# EAGLE design I2CIsoBreakoutV01 (EAGLE 6.3)
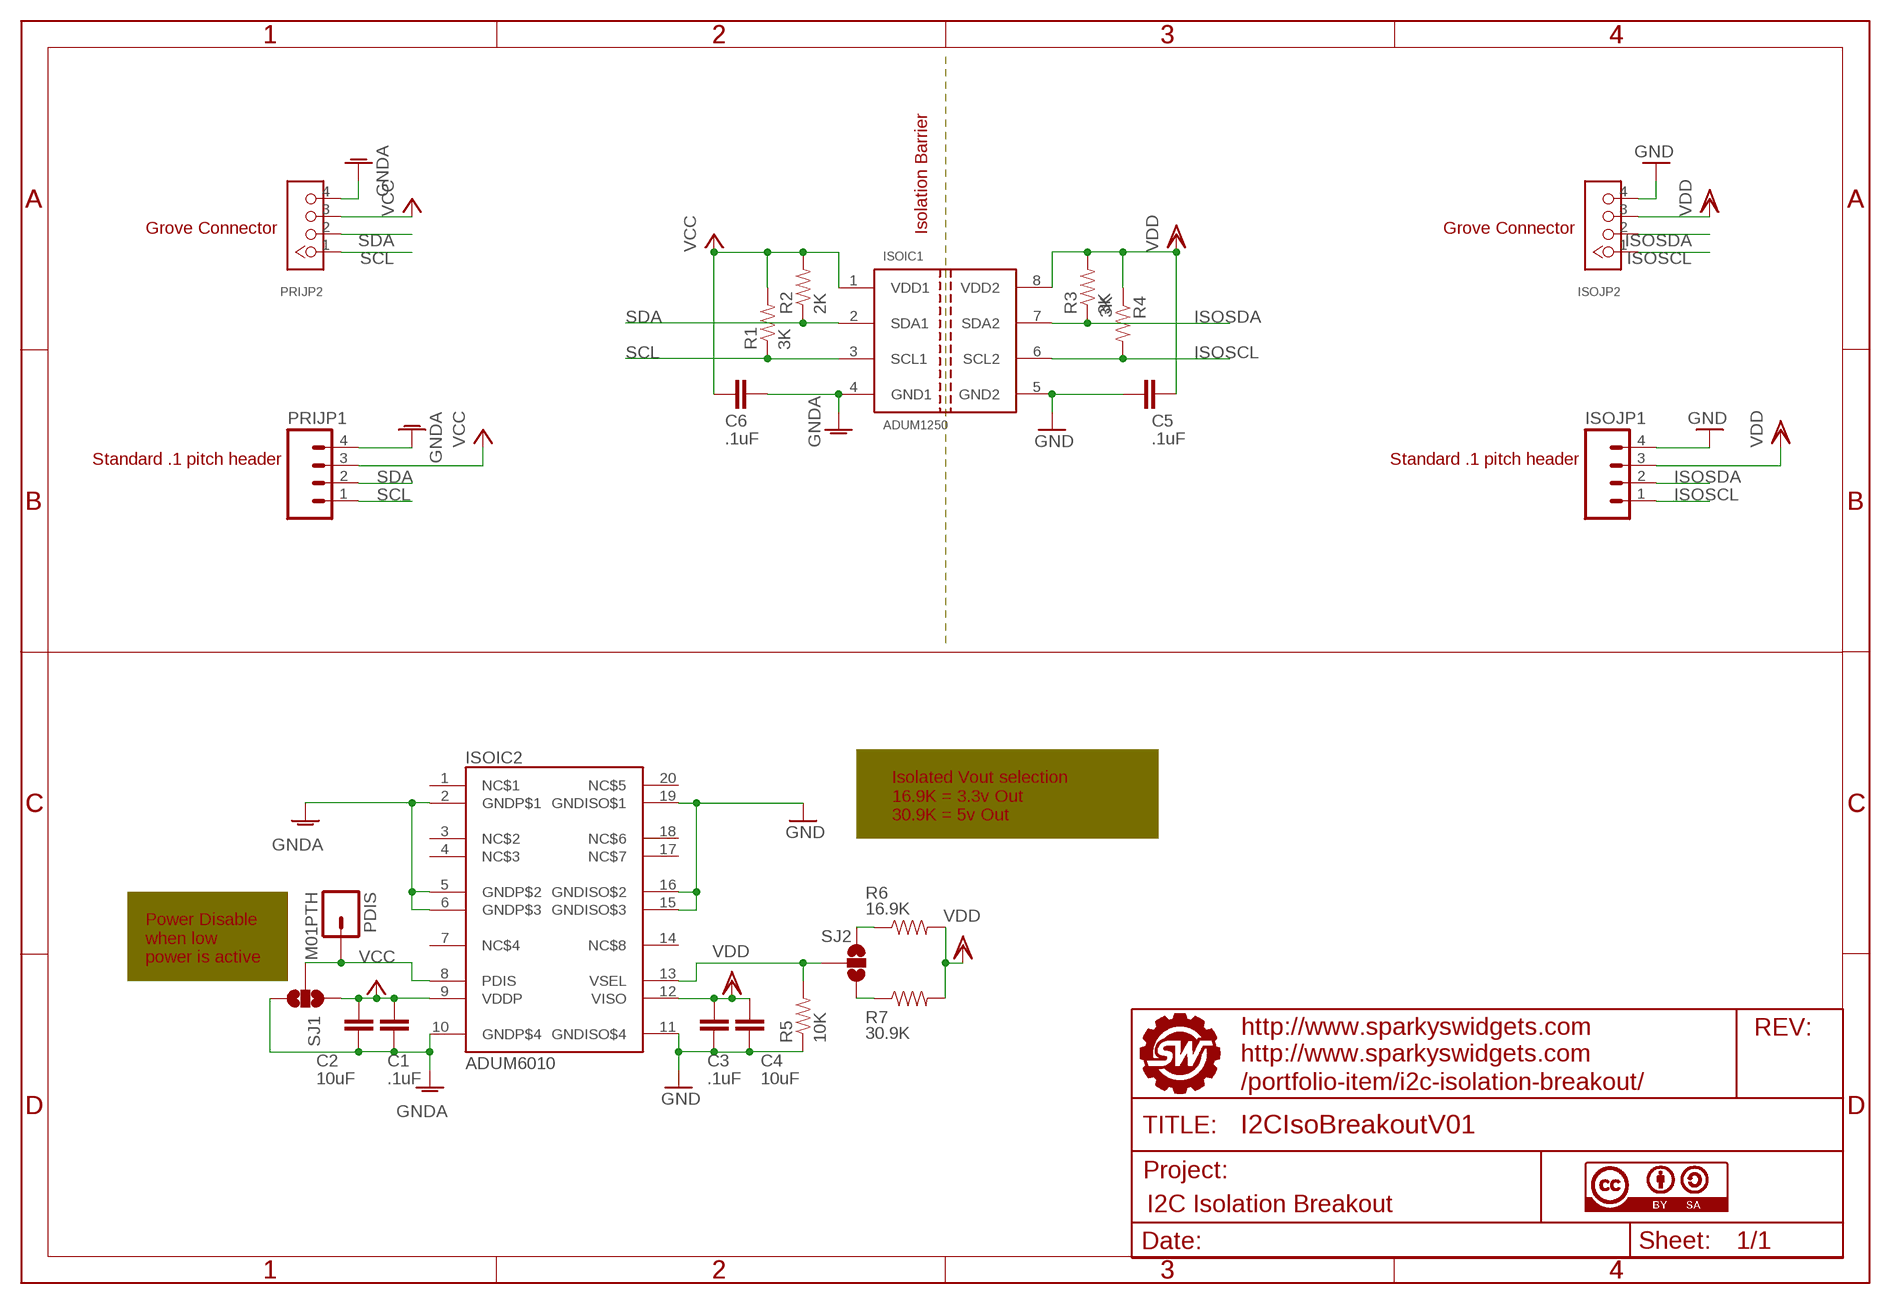
[diagram p0: schematic, sheet 1]

## Parts
C1  .1uF  CAP0805  [0805]
C2  10uF  CAP0805  [0805]
C3  .1uF  CAP0805  [0805]
C4  10uF  CAP0805  [0805]
C5  .1uF  CAP0805  [0805]
C6  .1uF  CAP0805  [0805]
ISOIC1  ADUM1250  [SO08]
ISOIC2  ADUM6010  [SSOP20]
ISOJP1  M04PTH  [1X04]
ISOJP2  TWIG-4P-2.0-2.0  [4P-2.0]
PDIS  M01PTH  [1X01]
PRIJP1  M04PTH  [1X04]
PRIJP2  TWIG-4P-2.0-2.0  [4P-2.0]
R1  3K  RESISTOR0805-RES  [0805]
R2  2K  RESISTOR0805-RES  [0805]
R3  3K  RESISTOR0805-RES  [0805]
R4  3K  RESISTOR0805-RES  [0805]
R5  10K  RESISTOR0805-RES  [0805]
R6  16.9K  RESISTOR0805-RES  [0805]
R7  30.9K  RESISTOR0805-RES  [0805]
SJ1  SOLDERJUMPER_2WAYPASTE2&3  [SJ_3_PASTE2&3]
SJ2  SOLDERJUMPER_2WAYPASTE2&3  [SJ_3_PASTE2&3]
U$1  FRAME_ISOI2CBREAKOUT  [SWPCBLOGOWITHINFO]
U$2  CC-BY-SA  [CC-BY-SA]

## Nets
GND: C3.2 C4.2 C5.1 ISOIC1.5(GND2) ISOIC2.11(GNDISO$4) ISOIC2.15(GNDISO$3) ISOIC2.16(GNDISO$2) ISOIC2.19(GNDISO$1) ISOJP1.4 ISOJP2.4 R5.1
GNDA: C1.2 C2.2 C6.1 ISOIC1.4(GND1) ISOIC2.2(GNDP$1) ISOIC2.5(GNDP$2) ISOIC2.6(GNDP$3) ISOIC2.10(GNDP$4) PRIJP1.4 PRIJP2.4 SJ1.3
ISOSCL: ISOIC1.6(SCL2) ISOJP1.1 ISOJP2.1 R4.2
ISOSDA: ISOIC1.7(SDA2) ISOJP1.2 ISOJP2.2 R3.1
N$1: ISOIC2.8(PDIS) PDIS.1 SJ1.2
N$2: ISOIC2.13(VSEL) R5.2 SJ2.2
N$3: R6.1 SJ2.1
N$4: R7.1 SJ2.3
SCL: ISOIC1.3(SCL1) PRIJP1.1 PRIJP2.1 R1.1
SDA: ISOIC1.2(SDA1) PRIJP1.2 PRIJP2.2 R2.1
VCC: C1.1 C2.1 C6.2 ISOIC1.1(VDD1) ISOIC2.9(VDDP) PRIJP1.3 PRIJP2.3 R1.2 R2.2 SJ1.1
VDD: C3.1 C4.1 C5.2 ISOIC1.8(VDD2) ISOIC2.12(VISO) ISOJP1.3 ISOJP2.3 R3.2 R4.1 R6.2 R7.2
Unconnected: ISOIC2.1(NC$1) ISOIC2.3(NC$2) ISOIC2.4(NC$3) ISOIC2.7(NC$4) ISOIC2.14(NC$8) ISOIC2.17(NC$7) ISOIC2.18(NC$6) ISOIC2.20(NC$5)

## Notes on the sheet
- Grove Connector | Isolation Barrier | Grove Connector
- Standard .1 pitch header | Standard .1 pitch header
- Isolated Vout selection
  16.9K = 3.3v Out
  30.9K = 5v Out
- Power Disable
  when low 
  power is active

## Library data of the parts
C1-C6 = SparkysWidgets:CAP: Capacitor Standard 0603 ceramic capacitor, and 0.1" leaded capacitor.
ISOIC1 = SparkysWidgets:ADUM1250: ADUM1250 Bi-Directional I2C Isolation IC AD iCoupler based tech, I2C Isolation IC, allows for Galavanically Isolated howswapable I2C devices
ISOIC2 = SparkysWidgets:ADUM6010: ADUM6010 ISO DC-DC power uModule AD iCoupler based tech, dc-dc converter. Useful for galvanically isolating supplies accepts wide inpute range and outputs regulated 3v-5.v5@150mA
ISOJP1 PRIJP1 = SparkFun:M04: Header 4 Standard 4-pin 0.1" header. Use with straight break away headers (SKU : PRT-00116), right angle break away headers (PRT-00553), swiss pins (PRT-00743), machine pins (PRT-00117), and female headers (PRT-00115). Molex polarized connector foot print use with SKU : PRT-08231 with associated crimp pins and housings. 1MM SMD Version SKU: PRT-10208
ISOJP2 PRIJP2 = Connector:TWIG-4P-2.0
PDIS = SparkFun:M01: Header 1 Standard 1-pin 0.1" header. Use with straight break away headers (SKU : PRT-00116), right angle break away headers (PRT-00553), swiss pins (PRT-00743), machine pins (PRT-00117), and female headers (PRT-00115).
R1-R7 = SparkysWidgets:RESISTOR: Resistor Basic schematic elements and footprints for 0603, 1206, and PTH resistors.
SJ1 SJ2 = SparkFun:SOLDERJUMPER_2WAY: Solder Jumper 2 way solder jumper
U$1 = SparkysWidgets:FRAME_ISOI2CBREAKOUT: A4 Sparky's Widgets frame This is a standard A4 Frame, the Doc Field has been modified with our Logo and contains the license and extra project information!; PROJECT: I2C Isolation Breakout; URL1: /portfolio-item/i2c-isolation-breakout/; URLHOME: http://www.sparkyswidgets.com; URLPROJECT: http://www.sparkyswidgets.com
U$2 = SparkysWidgets:CC-BY-SA

## Board
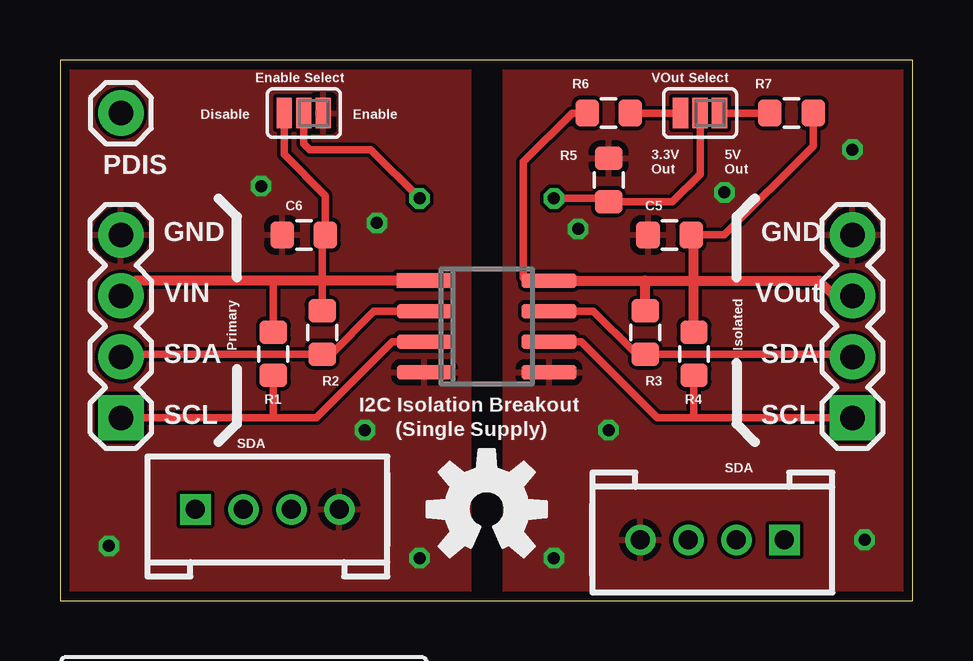
[diagram p1: board, top side]
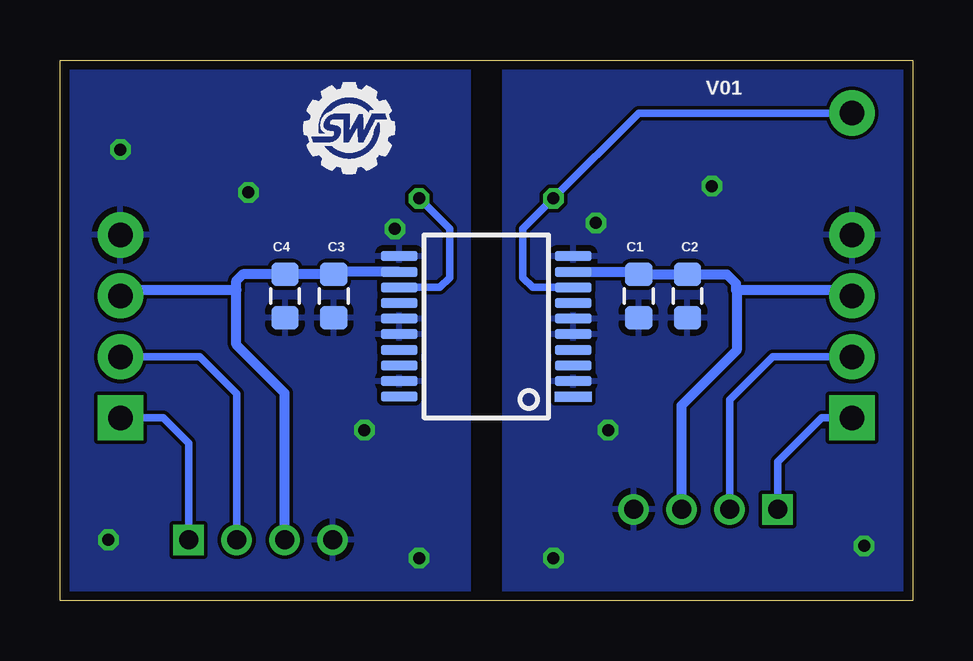
[diagram p2: board, bottom side, seen from below]

Size 35.54 x 22.53 mm. Coordinates in mm from the lower left corner, seen from the top.
Outline: 0,0 35.54,0 35.54,22.53 0,22.53 0,0
Copper layers (1*16): Top 0.0356mm / dielectric 1.5011mm / Bottom 0.0356mm
Design rules "LaenPCBOrder": minimum track width 6mil, minimum drill 13mil, track to track 6mil, track to pad 6mil, pad to pad 6mil, via to via 6mil, smd to smd 6mil, copper to edge 15mil, drill to drill 6mil, minimum pad ring 7mil, minimum via ring 7mil, stop-mask expansion 4mil, vias tented up to drill 0mil, thermal gap 10mil

### Footprints (pad centres in the part's own frame; a part is rotated, then mirrored left to right if it is on the bottom)
0805 = smd 0.984 x 1.143: 1 -0.9,0; 2 0.9,0
SO08 = smd 0.6 x 2.286: 1 -1.905,-2.6; 2 -0.635,-2.6; 3 0.635,-2.6; 4 1.905,-2.6; 5 1.905,2.6; 6 0.635,2.6; 7 -0.635,2.6; 8 -1.905,2.6
SSOP20 = smd 0.419 x 1.524: 1 -2.925,-3.625; 2 -2.275,-3.625; 3 -1.625,-3.625; 4 -0.975,-3.625; 5 -0.325,-3.625; 6 0.325,-3.625; 7 0.975,-3.625; 8 1.625,-3.625; 9 2.275,-3.625; 10 2.925,-3.625; 11 2.925,3.625; 12 2.275,3.625; 13 1.625,3.625; 14 0.975,3.625; 15 0.325,3.625; 16 -0.325,3.625; 17 -0.975,3.625; 18 -1.625,3.625; 19 -2.275,3.625; 20 -2.925,3.625
1X04 = drill 1.016 pad 1.88 square: 1 0,0 | drill 1.016 pad 1.88: 2 2.54,0; 3 5.08,0; 4 7.62,0
4P-2.0 = drill 0.8 pad 1.27 square: 1 -3,0 | drill 0.8 pad 1.27: 2 -1,0; 3 1,0; 4 3,0
1X01 = drill 1.016 pad 1.88: 1 0,0
SJ_3_PASTE2&3 = smd 0.635 x 1.27: 1 -0.813,0; 2 0,0; 3 0.813,0

### Placement (x,y rotation side)
C1  11.43,12.7 270 bottom
C2  9.4,12.7 270 bottom
C3  24.13,12.7 270 bottom
C4  26.16,12.7 270 bottom
C5  25.4,15.24 0 top
C6  10.16,15.24 0 top
ISOIC1  17.78,11.43 270 top
ISOIC2  17.78,11.43 90 bottom
ISOJP1  33.02,7.62 90 top
ISOJP2  27.18,2.54 180 top
PDIS  2.54,20.32 0 top
PRIJP1  2.54,7.62 90 top
PRIJP2  8.64,3.81 0 top
R1  8.89,10.29 90 top
R2  10.92,11.18 90 top
R3  24.38,11.18 90 top
R4  26.42,10.29 270 top
R5  22.86,17.53 270 top
R6  22.86,20.32 180 top
R7  30.48,20.32 0 top
SJ1  10.16,20.32 0 top
SJ2  26.67,20.32 0 top
U$1  25.4,17.78 0 bottom
U$2  0,-7.62 0 top  (outside the outline)
U$3  [OSHW-LOGO-M]  17.78,3.81 0 top

### Tracks (layer width: path | path; a pad name or v marks a point on that pad's centre or on a via)
GND  (via drill 0.5)
  other vias: 20.57,1.78 22.86,7.11 33.53,2.54 21.59,15.49 27.69,17.02 33.02,18.8
  pour Top: 36.07,23.37 18.54,23.37 18.54,-0.76 36.07,-0.76
  pour Bottom: 18.8,23.11 18.54,23.11 18.54,-0.51 35.81,-0.51 35.81,23.11
GNDA  (via drill 0.5)
  other vias: 8.38,17.27 13.21,15.75 12.7,7.11 14.99,1.78 2.03,2.29
  pour Top: -0.51,23.37 17.02,23.37 17.02,-0.76 -0.51,-0.76
  pour Bottom: -0.25,23.11 17.02,23.11 17.02,-0.51 -0.25,-0.51
ISOSCL
  Top 0.305: ISOJP1.1 26.42,7.62 | 26.42,7.62 24.89,7.62 21.72,10.79 ISOIC1.6 | R4.2 26.42,7.62
  Bottom 0.305: ISOJP2.1 30.18,6.56 31.24,7.62 ISOJP1.1
ISOSDA
  Top 0.305: ISOIC1.7 22.23,12.06 23.88,10.41 24.25,10.41 R3.1 32.9,10.28 ISOJP1.2
  Bottom 0.305: ISOJP2.2 28.18,8.62 29.72,10.16 ISOJP1.2
N$1  (via drill 0.5)
  Top 0.305: SJ1.2 10.16,19.05 10.41,18.8 12.95,18.8 v14.99,16.76
  Bottom 0.305: ISOIC2.8 15.85,13.05 16.26,13.46 16.26,15.49 v14.99,16.76 11.43,20.32 PDIS.1
N$2  (via drill 0.5)
  Top 0.305: v20.57,16.76 22.72,16.76 R5.2 25.52,16.63 26.67,17.78 SJ2.2
  Bottom 0.305: ISOIC2.13 19.71,13.05 19.3,13.46 19.3,15.49 v20.57,16.76
N$3
  Top 0.305: R6.1 SJ2.1
N$4
  Top 0.305: R7.1 SJ2.3
SCL
  Top 0.305: PRIJP1.1 8.89,7.62 | 8.89,7.62 10.67,7.62 13.84,10.79 ISOIC1.3 | R1.1 8.89,7.62
  Bottom 0.305: PRIJP2.1 5.64,5.79 3.81,7.62 PRIJP1.1
SDA
  Top 0.305: ISOIC1.2 13.08,12.06 11.29,10.28 R2.1 2.66,10.28 PRIJP1.2
  Bottom 0.305: PRIJP2.2 7.64,8.37 5.84,10.16 PRIJP1.2
VCC
  Top 0.305: SJ1.1 9.35,18.59 11.06,16.88 C6.2 10.92,15.1 10.92,13.34 R2.2 | R1.2 8.89,13.34
  Top 0.406: 2.79,12.95 PRIJP1.3 3.17,13.34 8.89,13.34 10.92,13.34 ISOIC1.1
  Bottom 0.406: 7.37,12.95 7.35,12.94 7.35,10.43 9.65,8.13 9.65,3.83 PRIJP2.3 | 7.37,12.95 2.79,12.95 PRIJP1.3 | 7.37,12.95 7.37,13.21 7.76,13.6 C2.1 C1.1 11.54,13.71 ISOIC2.9
VDD
  Top 0.305: R6.2 21.34,20.32 19.3,18.29 19.3,13.46 19.56,13.21 20.25,13.21 ISOIC1.8 | C5.2 27.69,15.24 31.38,18.93 R7.2
  Top 0.406: ISOJP1.3 32.26,12.7 31.62,13.34 26.42,13.34 | ISOIC1.8 24.38,13.34 | 24.38,13.34 26.42,13.34 | R3.2 24.38,13.34 | R4.1 26.42,13.34 | 26.42,13.34 26.42,15.12 C5.2
  Bottom 0.406: ISOIC2.12 24.02,13.71 C3.1 C4.1 27.93,13.6 28.19,13.34 28.19,12.95 | ISOJP2.3 26.18,8.65 28.19,10.67 28.19,12.95 | ISOJP1.3 32.77,12.95 28.19,12.95

### Text on the board
tPlace: Enable Select | VOut Select | Disable | Enable | PDIS | 3.3V / Out | 5V / Out | GND | GND | VIN | VOut | SDA | Primary | Isolated | SDA | I2C Isolation Breakout | SCL | (Single Supply) | SCL | SDA | SDA
bPlace: V01